# Altium schematic sheet PCIE98 Break Out.SchDoc
size A3
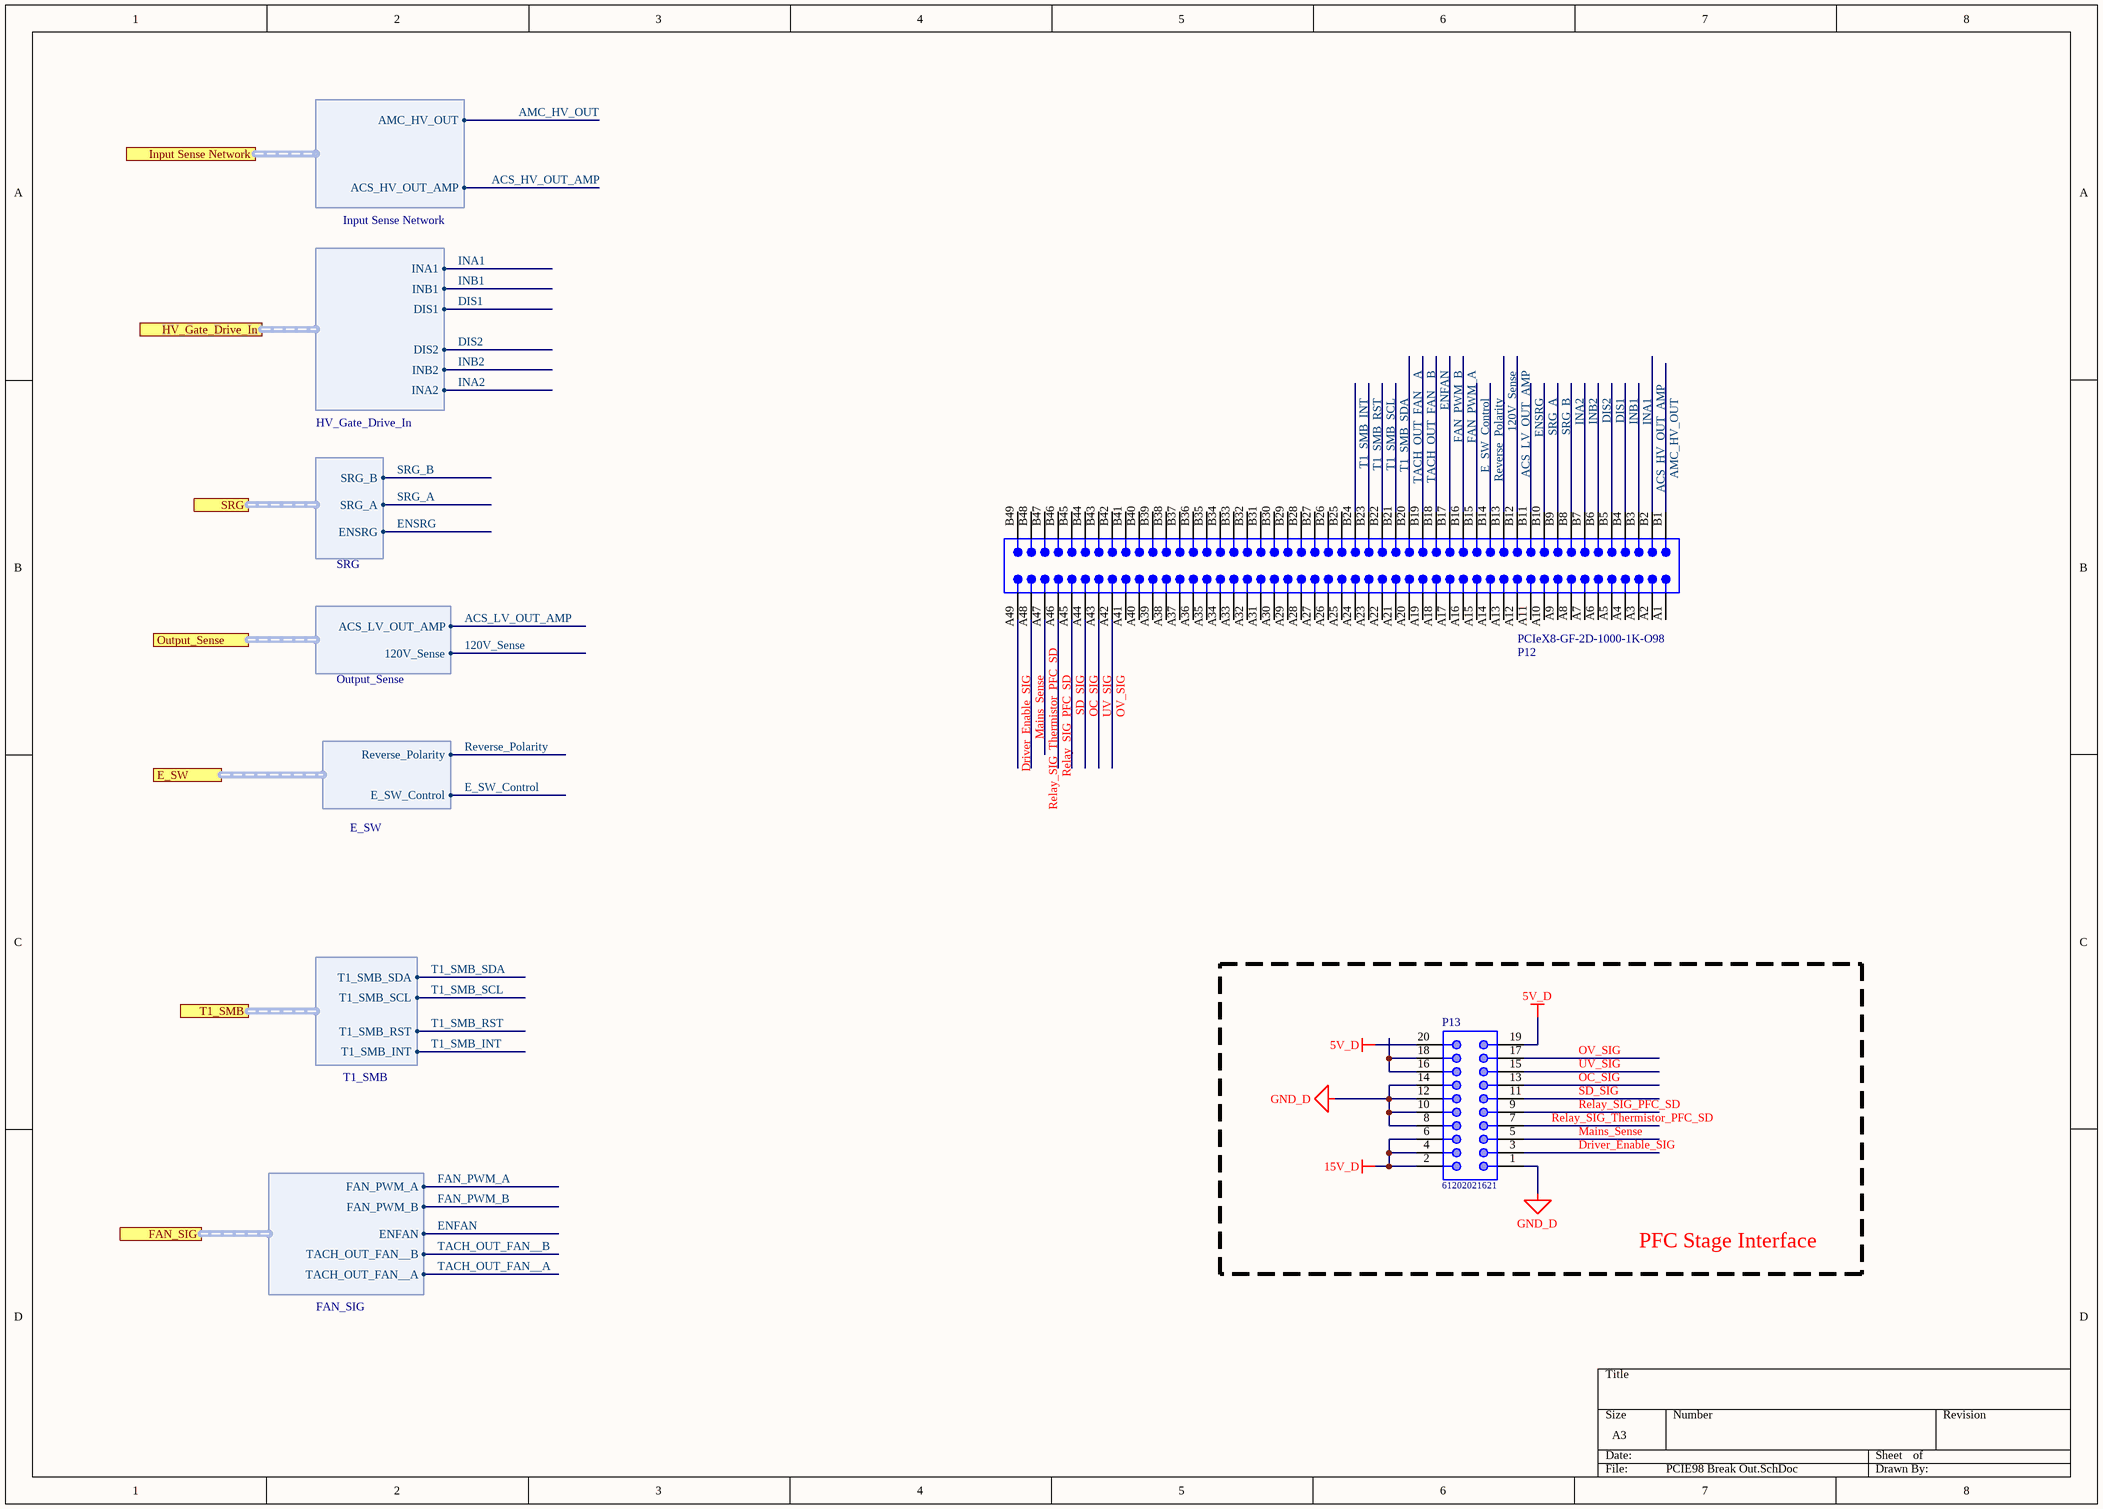
[diagram p0: PCIE98 Break Out.SchDoc]

## Parts
P12  PCIeX8-GF-2D-1000-1K-O98  [SMTC-PCIE-098-02-F-D-TH_V]  (no BOM)
P13  61202021621  [61202021621]

## Blocks framed on the sheet
PFC Stage Interface: P13

## Ports
E_SW (harness E_SW), FAN_SIG (harness FAN_SIG), HV_Gate_Drive_In (harness HV_Gate_Drive_In), Input Sense Network (harness Input Sense Network), Output_Sense (harness Output_Sense), SRG (harness SRG), T1_SMB (harness T1_SMB)

## Harnesses
Input Sense Network: ACS_HV_OUT_AMP, AMC_HV_OUT
HV_Gate_Drive_In: DIS1, DIS2, INA1, INA2, INB1, INB2
SRG: ENSRG, SRG_A, SRG_B
Output_Sense: 120V_Sense, ACS_LV_OUT_AMP
E_SW: E_SW_Control, Reverse_Polarity
T1_SMB: T1_SMB_INT, T1_SMB_RST, T1_SMB_SCL, T1_SMB_SDA
FAN_SIG: ENFAN, FAN_PWM_A, FAN_PWM_B, TACH_OUT_FAN__A, TACH_OUT_FAN__B

## Nets
5V_D: P13.19 P13.20
15V_D: P13.2 P13.4 P13.6
GND_D: P13.1 P13.8 P13.10 P13.12 P13.14
120V_Sense: P12.B13 ; port Output_Sense.120V_Sense
ACS_HV_OUT_AMP: P12.B2 ; port Input Sense Network.ACS_HV_OUT_AMP
ACS_LV_OUT_AMP: P12.B12 ; port Output_Sense.ACS_LV_OUT_AMP
AMC_HV_OUT: P12.B1 ; port Input Sense Network.AMC_HV_OUT
DIS1: P12.B5 ; port HV_Gate_Drive_In.DIS1
DIS2: P12.B6 ; port HV_Gate_Drive_In.DIS2
Driver_Enable_SIG: P12.A49 P13.3
E_SW_Control: P12.B15 ; port E_SW.E_SW_Control
ENFAN: P12.B18 ; port FAN_SIG.ENFAN
ENSRG: P12.B11 ; port SRG.ENSRG
FAN_PWM_A: P12.B16 ; port FAN_SIG.FAN_PWM_A
FAN_PWM_B: P12.B17 ; port FAN_SIG.FAN_PWM_B
INA1: P12.B3 ; port HV_Gate_Drive_In.INA1
INA2: P12.B8 ; port HV_Gate_Drive_In.INA2
INB1: P12.B4 ; port HV_Gate_Drive_In.INB1
INB2: P12.B7 ; port HV_Gate_Drive_In.INB2
Mains_Sense: P12.A48 P13.5
OC_SIG: P12.A44 P13.13
OV_SIG: P12.A42 P13.17
Relay_SIG_PFC_SD: P12.A46 P13.9
Relay_SIG_Thermistor_PFC_SD: P12.A47 P13.7
Reverse_Polarity: P12.B14 ; port E_SW.Reverse_Polarity
SD_SIG: P12.A45 P13.11
SRG_A: P12.B10 ; port SRG.SRG_A
SRG_B: P12.B9 ; port SRG.SRG_B
T1_SMB_INT: P12.B24 ; port T1_SMB.T1_SMB_INT
T1_SMB_RST: P12.B23 ; port T1_SMB.T1_SMB_RST
T1_SMB_SCL: P12.B22 ; port T1_SMB.T1_SMB_SCL
T1_SMB_SDA: P12.B21 ; port T1_SMB.T1_SMB_SDA
TACH_OUT_FAN__A: P12.B20 ; port FAN_SIG.TACH_OUT_FAN__A
TACH_OUT_FAN__B: P12.B19 ; port FAN_SIG.TACH_OUT_FAN__B
UV_SIG: P12.A43 P13.15
NetP13_16: P13.16 P13.18

Not connected (* = marked no-connect by the designer): P12 A1 A2 A3 A4 A5 A6 A7 A8 A9 A10 A11 A12 A13 A14 A15 A16 A17 A18 A19 A20 A21 A22 A23 A24 A25 A26 A27 A28 A29 A30 A31 A32 A33 A34 A35 A36 A37 A38 A39 A40 A41 B25 B26 B27 B28 B29 B30 B31 B32 B33 B34 B35 B36 B37 B38 B39 B40 B41 B42 B43 B44 B45 B46 B47 B48 B49

## Library data of the parts
P12 = PCIeX8-GF-2D-1000-1K-O98: Golden finger, PCIeX8, Dual, Opposite, Pitch 1mm, 98-Position; Mating Connector: Molex-87715-9205; Package Version: rev2.0, Apr-2007; ClassName: Edge Connector; Package Reference: GF-2D-1000-1K-O98; Datasheet Version: rev2.0, Apr-2007; Publisher: Altium
P13 = 61202021621: Male Box Header WR-BHD, THT, Vertical, pitch 2.54 mm, 20 pins; Pitch: 2.54 mm; Working Voltage: 250 VAC; Withstanding Voltage: 500 VAC; Contact Resistance: 20 mOhm; Pin Number: 20; ComponentLink1Description: Manufacturer; ComponentLink1URL: http://www.we-online.de; ComponentLink2Description: Datasheet; ComponentLink2URL: https://katalog.we-online.de/em/datasheet/6120xx21621.pdf; Part Number: 61202021621; Published Date: August 2018; Publisher: Wurth Elektronik; Operating Temperature: -40 to 125 degC; Packaging: Tray; Gender: Male; Mounting Technology: THT; Orientation: Vertical